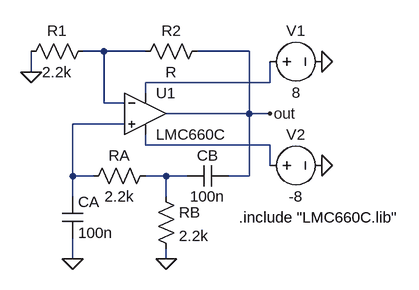
[diagram p0: schematic Draft2.asc]
Draft2.asc, the LTspice schematic file:
Version 4.1
SHEET 1 880 680
WIRE 144 -48 112 -48
WIRE 208 -48 144 -48
WIRE 368 -48 288 -48
WIRE 32 -16 32 -48
WIRE 400 0 400 -32
WIRE 400 0 208 0
WIRE 208 16 208 0
WIRE 144 32 144 -48
WIRE 176 32 144 32
WIRE 368 48 368 -48
WIRE 368 48 240 48
WIRE 400 48 368 48
WIRE 176 64 96 64
WIRE 208 96 208 80
WIRE 400 96 208 96
WIRE 400 128 400 96
WIRE 96 144 96 64
WIRE 128 144 96 144
WIRE 240 144 208 144
WIRE 272 144 240 144
WIRE 368 144 368 48
WIRE 368 144 336 144
WIRE 96 176 96 144
WIRE 240 176 240 144
WIRE 96 272 96 240
WIRE 240 272 240 256
FLAG 400 48 out
FLAG 96 272 0
FLAG 240 272 0
FLAG 32 -16 0
FLAG 480 -32 0
FLAG 480 128 0
SYMBOL cap 80 176 R0
SYMATTR InstName CA
SYMATTR Value 100n
SYMBOL res 224 128 R90
WINDOW 0 0 56 VBottom 2
WINDOW 3 32 56 VTop 2
SYMATTR InstName RA
SYMATTR Value 2.2k
SYMBOL res 224 160 R0
SYMATTR InstName RB
SYMATTR Value 2.2k
SYMBOL cap 336 128 R90
WINDOW 0 0 32 VBottom 2
WINDOW 3 32 32 VTop 2
SYMATTR InstName CB
SYMATTR Value 100n
SYMBOL OpAmps\\opamp2 208 -16 R0
SYMATTR InstName U1
SYMATTR Value LMC660C
SYMBOL res 304 -64 R90
WINDOW 0 0 56 VBottom 2
WINDOW 3 32 56 VTop 2
SYMATTR InstName R2
SYMBOL res 128 -64 R90
WINDOW 0 0 56 VBottom 2
WINDOW 3 32 56 VTop 2
SYMATTR InstName R1
SYMATTR Value 2.2k
SYMBOL voltage 384 -32 R270
WINDOW 0 32 56 VTop 2
WINDOW 3 -32 56 VBottom 2
WINDOW 123 0 0 Left 0
WINDOW 39 0 0 Left 0
SYMATTR InstName V1
SYMATTR Value 8
SYMBOL voltage 384 128 R270
WINDOW 0 32 56 VTop 2
WINDOW 3 -32 56 VBottom 2
WINDOW 123 0 0 Left 0
WINDOW 39 0 0 Left 0
SYMATTR InstName V2
SYMATTR Value -8
TEXT 352 208 Left 2 !.include "LMC660C.lib"

The netlist it stands for:
* Draft2.asc
CA N003 0 100n
RA N005 N003 2.2k
RB N005 0 2.2k
CB out N005 100n
X§U1 N003 N001 N002 N004 out LMC660C  ; pins In+ In- V+ V- OUT
R2 out N001 R
R1 N001 0 2.2k
V1 N002 0 8
V2 N004 0 -8
.include "LMC660C.lib"
.backanno
.end